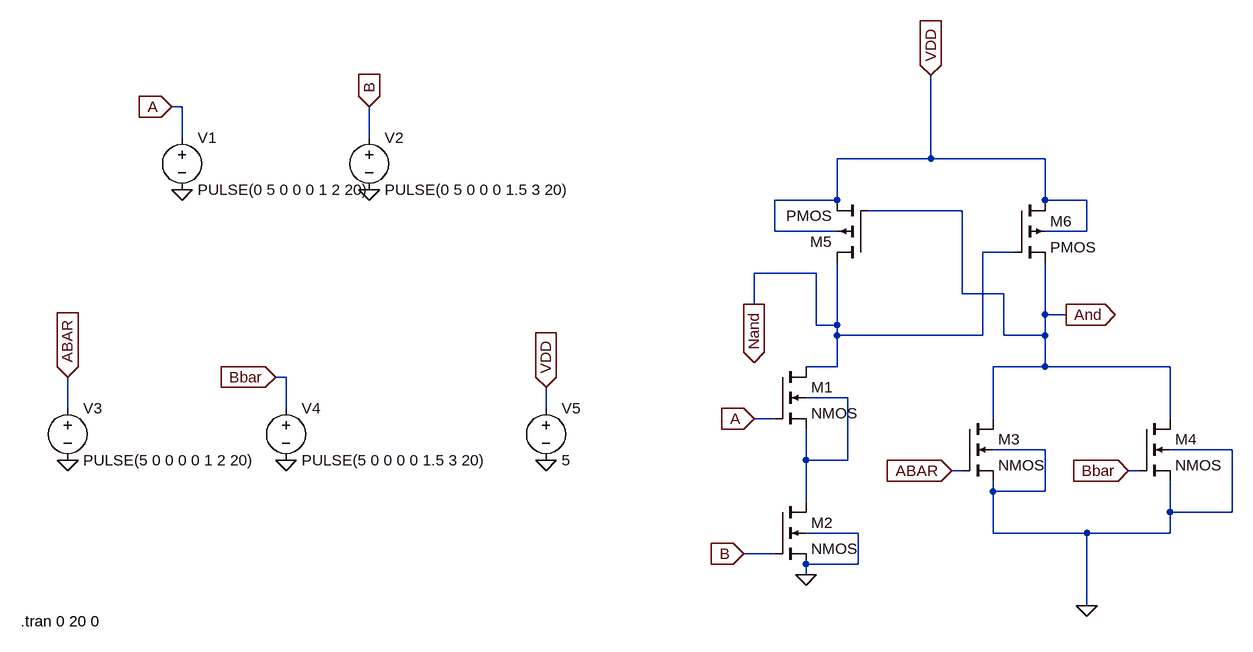
[diagram p0: schematic y10_1.asc]
y10_1.asc, the LTspice schematic file:
Version 4
SHEET 1 880 1000
WIRE -1008 192 -1024 192
WIRE -1008 240 -1008 192
WIRE -720 240 -720 192
WIRE 144 272 144 144
WIRE 144 272 0 272
WIRE 320 272 144 272
WIRE 0 336 0 272
WIRE 0 336 -96 336
WIRE 320 336 320 272
WIRE 384 336 320 336
WIRE 192 352 48 352
WIRE -96 384 -96 336
WIRE 0 384 -96 384
WIRE 384 384 384 336
WIRE 384 384 320 384
WIRE 272 416 224 416
WIRE -32 448 -128 448
WIRE 192 480 192 352
WIRE 256 480 192 480
WIRE -128 496 -128 448
WIRE 320 512 320 432
WIRE 352 512 320 512
WIRE -32 528 -32 448
WIRE 0 528 0 432
WIRE 0 528 -32 528
WIRE 0 544 0 528
WIRE 224 544 224 416
WIRE 224 544 0 544
WIRE 256 544 256 480
WIRE 320 544 320 512
WIRE 320 544 256 544
WIRE 0 592 0 544
WIRE 0 592 -48 592
WIRE 320 592 320 544
WIRE 320 592 240 592
WIRE 512 592 320 592
WIRE -848 608 -864 608
WIRE 16 640 -48 640
WIRE -1184 656 -1184 608
WIRE -848 656 -848 608
WIRE -448 656 -448 624
WIRE -96 672 -128 672
WIRE 240 672 240 592
WIRE 512 672 512 592
WIRE 320 720 240 720
WIRE 608 720 512 720
WIRE -48 736 -48 688
WIRE 16 736 16 640
WIRE 16 736 -48 736
WIRE 192 752 176 752
WIRE 464 752 448 752
WIRE 240 784 240 768
WIRE 320 784 320 720
WIRE 320 784 240 784
WIRE -48 800 -48 736
WIRE 512 816 512 768
WIRE 608 816 608 720
WIRE 608 816 512 816
WIRE 32 848 -48 848
WIRE 240 848 240 784
WIRE 384 848 240 848
WIRE 512 848 512 816
WIRE 512 848 384 848
WIRE -96 880 -144 880
WIRE 32 896 32 848
WIRE 32 896 -48 896
WIRE -48 912 -48 896
WIRE 384 960 384 848
FLAG -1008 320 0
FLAG -720 320 0
FLAG -1184 736 0
FLAG -848 736 0
FLAG -448 736 0
FLAG -1024 192 A
IOPIN -1024 192 In
FLAG -720 192 B
IOPIN -720 192 In
FLAG -1184 608 ABAR
IOPIN -1184 608 In
FLAG -864 608 Bbar
IOPIN -864 608 In
FLAG -448 624 VDD
IOPIN -448 624 In
FLAG 144 144 VDD
IOPIN 144 144 In
FLAG -48 912 0
FLAG 384 960 0
FLAG -128 672 A
IOPIN -128 672 In
FLAG -144 880 B
IOPIN -144 880 In
FLAG 176 752 ABAR
IOPIN 176 752 In
FLAG 448 752 Bbar
IOPIN 448 752 In
FLAG -128 496 Nand
IOPIN -128 496 Out
FLAG 352 512 And
IOPIN 352 512 Out
SYMBOL voltage -1008 224 R0
WINDOW 123 0 0 Left 0
WINDOW 39 0 0 Left 0
SYMATTR InstName V1
SYMATTR Value PULSE(0 5 0 0 0 1 2 20)
SYMBOL voltage -720 224 R0
WINDOW 123 0 0 Left 0
WINDOW 39 0 0 Left 0
SYMATTR InstName V2
SYMATTR Value PULSE(0 5 0 0 0 1.5 3 20)
SYMBOL voltage -1184 640 R0
WINDOW 123 0 0 Left 0
WINDOW 39 0 0 Left 0
SYMATTR InstName V3
SYMATTR Value PULSE(5 0 0 0 0 1 2 20)
SYMBOL voltage -848 640 R0
WINDOW 123 0 0 Left 0
WINDOW 39 0 0 Left 0
SYMATTR InstName V4
SYMATTR Value PULSE(5 0 0 0 0 1.5 3 20)
SYMBOL voltage -448 640 R0
WINDOW 123 0 0 Left 0
WINDOW 39 0 0 Left 0
SYMATTR InstName V5
SYMATTR Value 5
SYMBOL nmos4 -96 592 R0
SYMATTR InstName M1
SYMBOL nmos4 -96 800 R0
SYMATTR InstName M2
SYMBOL nmos4 192 672 R0
SYMATTR InstName M3
SYMBOL nmos4 464 672 R0
SYMATTR InstName M4
SYMBOL pmos4 48 432 R180
SYMATTR InstName M5
SYMBOL pmos4 272 336 R0
SYMATTR InstName M6
TEXT -1256 984 Left 2 !.tran 0 20 0

The netlist it stands for:
* y10_1.asc
V1 A 0 PULSE(0 5 0 0 0 1 2 20)
V2 B 0 PULSE(0 5 0 0 0 1.5 3 20)
V3 ABAR 0 PULSE(5 0 0 0 0 1 2 20)
V4 Bbar 0 PULSE(5 0 0 0 0 1.5 3 20)
V5 VDD 0 5
M1 Nand A N001 N001 NMOS
M2 N001 B 0 0 NMOS
M3 And ABAR 0 0 NMOS
M4 And Bbar 0 0 NMOS
M5 Nand And VDD VDD PMOS
M6 VDD Nand And VDD PMOS
.model NMOS NMOS
.model PMOS PMOS
.lib standard.mos
.tran 0 20 0
.backanno
.end